# Altium schematic sheet Battery_Input.SchDoc: =SheetTitle
size B; SheetTitle: Battery Input; DrawnBy: Samyar Sadat Akhavi; SheetNumber: 2; SheetTotal: 19
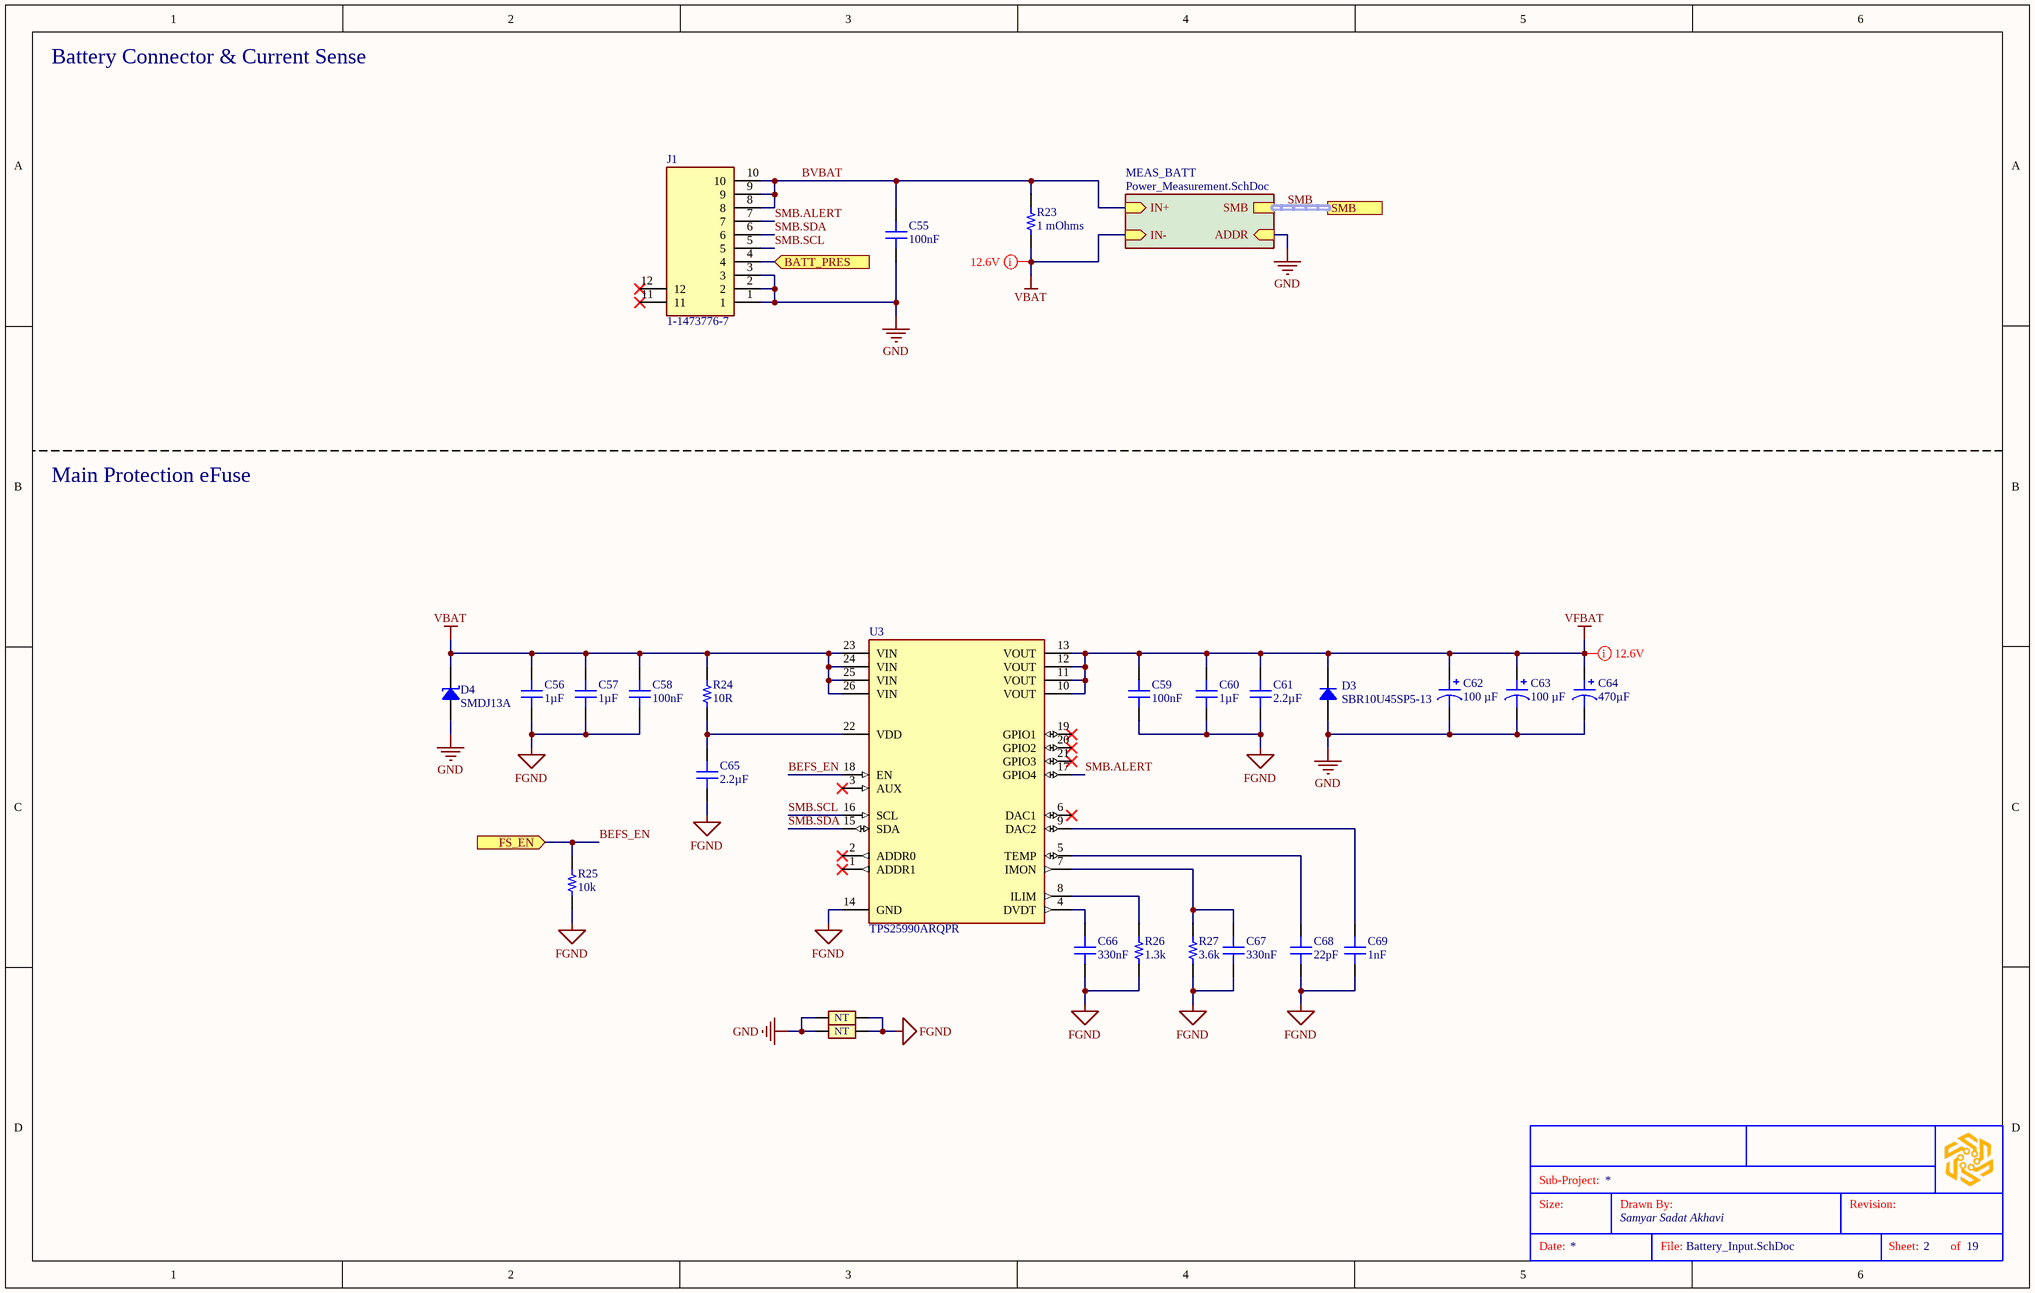
[diagram p0: Battery_Input.SchDoc]

## Parts
?  (no value)  (graphical)
C55  100nF  [CAP 0603_1608]
C56  1µF  [CAP 0603_1608]
C57  1µF  [CAP 0603_1608]
C58  100nF  [CAP 0603_1608]
C59  100nF  [CAP 0603_1608]
C60  1µF  [CAP 0603_1608]
C61  2.2µF  [CAP 0805_2012]
C62  100 µF  [CAP ALSMD 6.6MM H7.7MM]
C63  100 µF  [CAP ALSMD 6.6MM H7.7MM]
C64  470µF  [CAP_A781-MN_KEM]
C65  2.2µF  [CAP 0805_2012]
C66  330nF  [CAP 0603_1608]
C67  330nF  [CAP 0603_1608]
C68  22pF  [CAP 0603_1608]
C69  1nF  [CAP 0603_1608]
D3  SBR10U45SP5-13  [DIODES INC SDT10A45P5]
D4  SMDJ13A  [DO214AB SMC]
J1  1-1473776-7  [114737767]
NT6  Net Tie  [Net_Tie_Via]  (value not drawn)  (net tie, no BOM)
NT7  Net Tie  [Net_Tie_Via]  (value not drawn)  (net tie, no BOM)
R23  1 mOhms  [RES 2512_6432]
R24  10R  [RES 0603_1608]
R25  10k  [RES 0603_1608]
R26  1.3k  [RES 0603_1608]
R27  3.6k  [RES 0603_1608]
U3  TPS25990ARQPR  [VQFN26_RQP_TEX]

## Sub-sheets
MEAS_BATT = Power_Measurement.SchDoc: SMB (harness SMBus), ADDR (in), IN+ (in), IN- (in)

## Ports
BATT_PRES (in, see Power_Board[1B], User_Control_IO[2B]), FS_EN (in, see Power_Board[2B]), SMB (harness SMBus, see Power_Board[1B], Power_Measurement[3B], VBAT_Output[3B])

## Nets
FGND: C56.1 C57.1 C58.2 C59.2 C60.1 C61.1 C65.1 C66.1 C67.1 C68.1 C69.1 NT6.2 NT7.2 R25.2 R26.1 R27.1 U3.14(GND)
GND: C55.2 C62.2 C63.2 C64.2 D3.2 D4.1 J1.1 J1.2 J1.3 NT6.1 NT7.1 ; sheet MEAS_BATT/ADDR
VBAT: C56.2 C57.2 C58.1 D4.2 R23.1 R24.2 U3.23(VIN) U3.24(VIN) U3.25(VIN) U3.26(VIN) ; sheet MEAS_BATT/IN-
VFBAT: C59.1 C60.2 C61.2 C62.1 C63.1 C64.1 D3.1 U3.10(VOUT) U3.11(VOUT) U3.12(VOUT) U3.13(VOUT)
BATT_PRES: J1.4 ; port BATT_PRES
BEFS_EN: R25.1 U3.18(EN) ; port FS_EN
BVBAT: C55.1 J1.8 J1.9 J1.10 R23.2 ; sheet MEAS_BATT/IN+
SMB.ALERT: J1.7 U3.17(GPIO4)
SMB.SCL: J1.5 U3.16(SCL)
SMB.SDA: J1.6 U3.15(SDA)
NetC65_2: C65.2 R24.1 U3.22(VDD)
NetC66_2: C66.2 U3.4(DVDT)
NetC67_2: C67.2 R27.2 U3.7(IMON)
NetC68_2: C68.2 U3.5(TEMP)
NetC69_2: C69.2 U3.9(DAC2)
NetR26_2: R26.2 U3.8(ILIM)

Not connected (* = marked no-connect by the designer): J1 11* 12*; U3 1(ADDR1)* 2(ADDR0)* 3(AUX)* 6(DAC1)* 19(GPIO1)* 20(GPIO2)* 21(GPIO3)*

## Buses and harness runs
harness SMB = port SMB = sheet MEAS_BATT/SMB

## Layout directives
rule Supply Nets [Voltage = 12.60]: VBAT, VFBAT

## Notes on the sheet
- Battery Connector & Current Sense
- Main Protection eFuse
- Sub-Project:
- Size:
- Drawn By:
- Revision:
- Date:
- File:
- Sheet:
- of
- (in symbol GEN-PCBVINT0S3) NT

## Library data of the parts
? = SGR-STDTBSB: STANDARD SCHEMATICS TITLE BLOCK
C55 C58 C59 = GEN-CC100NT10V50KX7R603: GENERIC 0603 MLC CAPACITOR; Tolerance: ±10%; Voltage: 50V; Dielectric: X7R; Part Number: GEN-CC100NT10V50KX7R603; Value: 100nF
C56 C57 C60 = GEN-CC1UT10V25KX7R603: GENERIC 0603 MLC CAPACITOR; Tolerance: ±10%; Voltage: 25V; Dielectric: X7R; Part Number: GEN-CC1UT10V25KX7R603; Value: 1µF
C61 C65 = GEN-CC2U2T10V25KX7R805: GENERIC 0805 MLC CAPACITOR; Tolerance: ±10%; Voltage: 25V; Dielectric: X7R; Part Number: GEN-CC2U2T10V25KX7R805; Value: 2.2µF
C62 C63 = 865080445010: CAP ALUM 100UF 20% 25V SMD; manufacturer: Würth Elektronik; Impedance: 380 mOhms; Lifetime @ Temp.: 2000 Hrs @ 105°C; Polarization: Polar; Ripple Current @ High Frequency: 290 mA @ 100 kHz; Ripple Current @ Low Frequency: 188.5 mA @ 120 Hz; Surface Mount Land Size: 0.260" L x 0.260" W (6.60mm x 6.60mm); Part Number: 865080445010; Applications: General Purpose; Capacitance: 100 µF; componentlink1description: Datasheet; componentlink1url: https://katalog.we-online.de/pbs/datasheet/865080445010.pdf; componentlink2description: DigiKey Link; componentlink2url: https://www.digikey.com/en/products/detail/würth-elektronik/865080445010/5728033; Device Package: Radial, Can - SMD; Height - Seated (Max): 0.303" (7.70mm); lastupdated: 4/5/2026 8:54:41 PM; Lifecycle Status: Active; Minimum Order: 1; Mounting Type: Surface Mount; Operating Temperature: -55°C ~ 105°C; Package / Case: Radial, Can - SMD; packaging: TapeAndReel; partid: 8228; Part Status: Active; price: 0.16; series: WCAP-ASLI; Size / Dimension: 0.248" Dia (6.30mm); Supplier 1: DigiKey; Supplier Part Number 1: 732-8438-1-ND; Tolerance: ±20%; value: 100 µF; Voltage - Rated: 25 V
C64 = A781MN477M1ELAS025: CAP ALUM HYB 470UF 20% 25V SMD; Manufacturer: KEMET; ESR: 25mOhm; Lifetime Temp: 2000 Hrs @ 135°C; Part Number: A781MN477M1ELAS025; Value: 470µF; Tolerance: ±20%; Voltage: 25V; Supplier 1: DigiKey; Supplier Part Number 1: 399-A781MN477M1ELAS025CT-ND
C66 C67 = GEN-CC330NT10V16KX7R603: GENERIC 0603 MLC CAPACITOR; Tolerance: ±10%; Voltage: 16V; Dielectric: X7R; Part Number: GEN-CC330NT10V16KX7R603; Value: 330nF
C68 = GEN-CC22PT10V16KX7R603: GENERIC 0603 MLC CAPACITOR; Tolerance: ±10%; Voltage: 16V; Dielectric: X7R; Part Number: GEN-CC22PT10V16KX7R603; Value: 22pF
C69 = GEN-CC1NT10V16KX7R603: GENERIC 0603 MLC CAPACITOR; Tolerance: ±10%; Voltage: 16V; Dielectric: X7R; Part Number: GEN-CC1NT10V16KX7R603; Value: 1nF
D3 = SBR10U45SP5-13: DIODE SBR 45V 10A POWERDI5; Manufacturer: Diodes Incorporated; Current - Reverse Leakage @ Vr: 300 µA @ 45 V; Diode Type: Super Barrier; Speed: Fast Recovery =< 500ns, > 200mA (Io); Voltage - Forward (Vf) (Max) @ If: 470 mV @ 10 A; Part Number: SBR10U45SP5-13; ComponentLink1Description: Datasheet; ComponentLink1URL: https://www.diodes.com/assets/Datasheets/SBR10U45SP5.pdf; ComponentLink2Description: DigiKey Link; ComponentLink2URL: https://www.digikey.com/en/products/detail/diodes-incorporated/SBR10U45SP5-13/1935355; Current - Average Rectified (Io): 10A; LastUpdated: 4/5/2026 9:26:20 PM; Lifecycle Status: Active; Minimum Order: 1; Mounting Type: Surface Mount; Operating Temperature - Junction: -65°C ~ 150°C; Package / Case: PowerDI™ 5; Packaging: TapeAndReel; PartId: 3714; Part Status: Active; Price: 0.27; Series: SBR®; Supplier 1: DigiKey; Supplier Part Number 1: SBR10U45SP5-13DICT-ND; Supplier Device Package: PowerDI™ 5; Voltage - DC Reverse (Vr) (Max): 45 V
D4 = SMDJ13A: TVS DIODE 13VWM 21.5VC DO214AB; Manufacturer: Littelfuse Inc.; Current - Peak Pulse (10/1000µs): 139.5A; Power Line Protection: No; Power - Peak Pulse: 3000W (3kW); Type: Zener; Unidirectional Channels: 1; Voltage - Breakdown (Min): 14.4V; Voltage - Clamping (Max) @ Ipp: 21.5V; Voltage - Reverse Standoff (Typ): 13V; Part Number: SMDJ13A; Applications: General Purpose; ComponentLink1Description: Datasheet; ComponentLink1URL: https://www.littelfuse.com/~/media/electronics/datasheets/tvs_diodes/littelfuse_tvs_diode_smdj_datasheet.pdf.pdf; ComponentLink2Description: DigiKey Link; ComponentLink2URL: https://www.digikey.com/en/products/detail/littelfuse-inc/SMDJ13A/2024476; LastUpdated: 4/5/2026 8:33:53 PM; Lifecycle Status: Active; Minimum Order: 1; Mounting Type: Surface Mount; Operating Temperature: -65°C ~ 150°C (TJ); Package / Case: DO-214AB, SMC; Packaging: TapeAndReel; PartId: 6478; Part Status: Active; Price: 0.33; Series: SMDJ; Supplier 1: DigiKey; Supplier Part Number 1: SMDJ13ACT-ND; Supplier Device Package: DO-214AB (SMCJ)
J1 = 1-1473776-7: CONN RCPT 10POS 2.50MM PCB SLDR; Manufacturer: TE Connectivity AMP Connectors; Part Number: 1-1473776-7; Supplier 1: DigiKey; Supplier Part Number 1: A120254-ND
NT6 NT7 = GEN-PCBVINT0S3: VIA STYLE CIRCULAR NET TIE; Part Number: GEN-PCBVINT0S3; Size Variant: 0.3mm
R23 = TLR3A20DR001FTDG: RES 0.001 OHM 1% 2W 2512; manufacturer: TE Connectivity Passive Product; Temperature Coefficient: ±50ppm/°C; Part Number: TLR3A20DR001FTDG; componentlink1description: Datasheet; componentlink1url: https://www.te.com/commerce/DocumentDelivery/DDEController?Action=srchrtrv&DocNm=1773449-3&DocType=DS&DocLang=English; componentlink2description: DigiKey Link; componentlink2url: http://digikey.com/product-detail/en/te-connectivity-passive-product/TLR3A20DR001FTDG/A129565CT-ND/8566769; Composition: Metal Foil; Device Package: 2512 (6432 Metric); Features: Current Sense; Height - Seated (Max): 0.024" (0.60mm); lastupdated: 9/2/2020 1:27:06 AM; Lifecycle Status: Active; Minimum Order: 1; Number of Terminations: 2; Operating Temperature: -55°C ~ 170°C; Package / Case: 2512 (6432 Metric); packaging: TapeAndReel; Part Status: Active; Power (Watts): 2W; price: 0.30; Resistance: 1 mOhms; series: TLR, CGS; Size / Dimension: 0.252" L x 0.126" W (6.40mm x 3.20mm); Supplier 1: DigiKey; Supplier Part Number 1: A129565CT-ND; Supplier Device Package: 2512; Tolerance: ±1%; value: 1 mOhms
R24 = GEN-CRR10T1P8603: GENERIC 0603 CHIP RESISTOR; Tolerance: ±1%; Power: 0.125W; Part Number: GEN-CRR10T1P8603; Value: 10R
R25 = GEN-CRR10KT1P8603: GENERIC 0603 CHIP RESISTOR; Tolerance: ±1%; Power: 0.125W; Part Number: GEN-CRR10KT1P8603; Value: 10k
R26 = GEN-CRR1K3T1P8603: GENERIC 0603 CHIP RESISTOR; Tolerance: ±1%; Power: 0.125W; Part Number: GEN-CRR1K3T1P8603; Value: 1.3k
R27 = GEN-CRR3K6T1P8603: GENERIC 0603 CHIP RESISTOR; Tolerance: ±1%; Power: 0.125W; Part Number: GEN-CRR3K6T1P8603; Value: 3.6k
U3 = TPS25990ARQPR: ELECTRONIC FUSE; Manufacturer: Texas Instruments; Part Number: TPS25990ARQPR; Supplier 1: DigiKey; Supplier Part Number 1: 296-TPS25990ARQPRCT-ND